# EAGLE schematic Balise ir émmetrice (EAGLE 6.1)
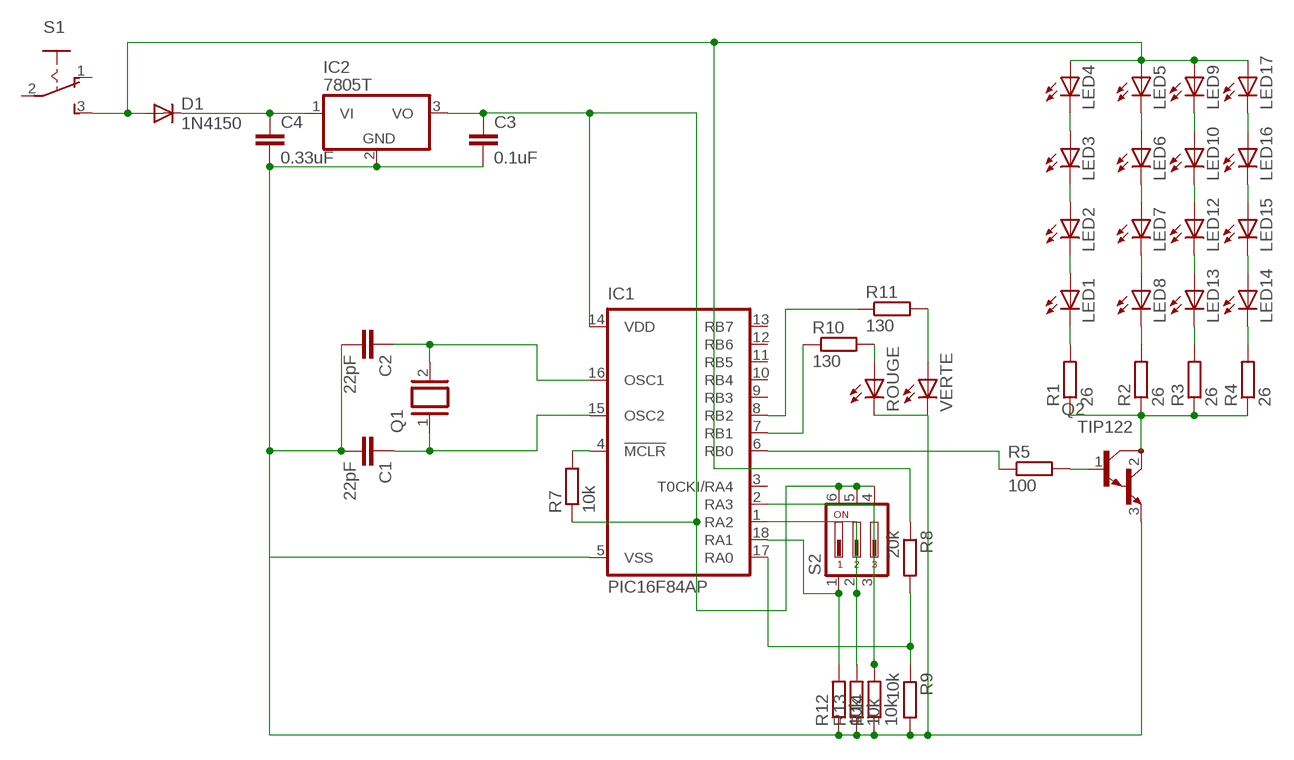
[diagram p0: schematic, sheet 1]

## Parts
C1  22pF  C2.5/4  [C2.5-4]
C2  22pF  C2.5/4  [C2.5-4]
C3  0.1uF  C2.5/4  [C2.5-4]
C4  0.33uF  C2.5/4  [C2.5-4]
D1  1N4150  1N4148DO35-7  [DO35-7]
IC1  PIC16F84AP  [DIL18]
IC2  7805T  [TO220H]
LED1  LED3MM  [LED3MM]
LED2  LED3MM  [LED3MM]
LED3  LED3MM  [LED3MM]
LED4  LED3MM  [LED3MM]
LED5  LED3MM  [LED3MM]
LED6  LED3MM  [LED3MM]
LED7  LED3MM  [LED3MM]
LED8  LED3MM  [LED3MM]
LED9  LED3MM  [LED3MM]
LED10  LED3MM  [LED3MM]
LED12  LED3MM  [LED3MM]
LED13  LED3MM  [LED3MM]
LED14  LED3MM  [LED3MM]
LED15  LED3MM  [LED3MM]
LED16  LED3MM  [LED3MM]
LED17  LED3MM  [LED3MM]
Q1  XTAL/S  [QS]
Q2  TIP122  [TO220]
R1  26  R-EU_0204/7  [0204/7]
R2  26  R-EU_0204/7  [0204/7]
R3  26  R-EU_0204/7  [0204/7]
R4  26  R-EU_0204/7  [0204/7]
R5  100  R-EU_0204/7  [0204/7]
R7  10k  R-EU_0207/5V  [0207/5V]
R8  20k  R-EU_0207/5V  [0207/5V]
R9  10k  R-EU_0207/5V  [0207/5V]
R10  130  R-EU_0207/5V  [0207/5V]
R11  130  R-EU_0207/5V  [0207/5V]
R12  10k  R-EU_0207/5V  [0207/5V]
R13  10k  R-EU_0207/5V  [0207/5V]
R14  10k  R-EU_0207/5V  [0207/5V]
ROUGE  LED5MM  [LED5MM]
S1  255SB  [255SB]
S2  DIP03YL  [DIP03YL]
VERTE  LED5MM  [LED5MM]

## Nets
N$1: IC1.4(!MCLR) R7.2
N$2: IC1.7(RB1) R10.1
N$3: R10.2 ROUGE.A
N$4: C4.1 D1.C IC2.1(VI)
N$5: C1.2 C2.2 C3.2 C4.2 IC1.5(VSS) IC2.2(GND) Q2.3(E) R9.2 R12.1 R13.1 R14.1 ROUGE.K(C) VERTE.K(C)
N$7: C1.1 IC1.15(OSC2) Q1.1
N$8: C2.1 IC1.16(OSC1) Q1.2
N$9: C3.1 IC1.14(VDD) IC2.3(VO) R7.1 S2.4 S2.5 S2.6
N$10: Q2.2(C) R1.1 R2.1 R3.1 R4.1
N$11: IC1.6(RB0) R5.1
N$12: Q2.1(B) R5.2
N$13: LED1.K(C) R1.2
N$14: LED1.A LED2.K(C)
N$15: LED2.A LED3.K(C)
N$16: LED3.A LED4.K(C)
N$17: IC1.1(RA2) R13.2 S2.2
N$18: LED16.A LED17.K(C)
N$19: LED9.K(C) LED10.A
N$20: LED5.K(C) LED6.A
N$21: LED6.K(C) LED7.A
N$22: LED10.K(C) LED12.A
N$23: LED15.A LED16.K(C)
N$24: LED7.K(C) LED8.A
N$25: LED12.K(C) LED13.A
N$26: LED14.A LED15.K(C)
N$27: LED14.K(C) R4.2
N$28: LED13.K(C) R3.2
N$29: LED8.K(C) R2.2
N$31: IC1.8(RB2) R11.1
N$32: R11.2 VERTE.A
N$35: IC1.18(RA1) R12.2 S2.1
N$36: IC1.2(RA3) R14.2 S2.3
N$37: IC1.17(RA0) R8.2 R9.1
N$39: D1.A LED4.A LED5.A LED9.A LED17.A R8.1 S1.3(S)
Unconnected: IC1.3(T0CKI/RA4) IC1.9(RB3) IC1.10(RB4) IC1.11(RB5) IC1.12(RB6) IC1.13(RB7) S1.1(O) S1.2(P)

## Library data of the parts
C1-C4 = capacitor-wima:C: CAPACITOR naming: grid - package width
D1 = diode:1N4148: DIODE high speed (Philips)
IC1 = microchip:PIC16F8*: MICROCONTROLLER 8-Bit PIC16F8X Family - CMOS Flash/EEPROM Pin Compatible : PIC16F83, PIC16CR83, PIC16F84A, PIC16CR84 see also PIC16C* <DEVICE:PIC16C*>; MF: MICROCHIP; MPN: PIC16F84A-04I/P; OC_FARNELL: 9760865; OC_NEWARK: 69K7635
IC2 = linear:78*: Positive VOLTAGE REGULATOR Source: http://cache.national.com/ds/LM/LM78L05.pdf http://www.fairchildsemi.com/ds/LM/LM7805.pdf
LED1-LED10 LED12-LED17 ROUGE VERTE = led:LED: LED OSRAM: - CHIPLED LG R971, LG N971, LY N971, LG Q971, LY Q971, LO R971, LY R971 LH N974, LH R974 LS Q976, LO Q976, LY Q976 LO Q996 - Hyper CHIPLED LW Q18S LB Q993, LB Q99A, LB R99A - SideLED LS A670, LO A670, LY A670, LG A670, LP A670 LB A673, LV A673, LT A673, LW A673 LH A674 LY A675 LS A676, LA A676, LO A676, LY A676, LW A676 LS A679, LY A679, LG A679 - Hyper Micro SIDELED® LS Y876, LA Y876, LO Y876, LY Y876 LT Y87S - SmartLED LW L88C, LW L88S LB L89C, LB L89S, LG L890 LS L89K, LO L89K, LY L89K LS L896, LA L896, LO L896, LY L896 - TOPLED LS T670, LO T670, LY T670, LG T670, LP T670 LSG T670, LSP T670, LSY T670, LOP T670, LYG T670 LG T671, LOG T671, LSG T671 LB T673, LV T673, LT T673, LW T673 LH T674 LS T676, LA T676, LO T676, LY T676, LB T676, LH T676, LSB T676, LW T676 LB T67C, LV T67C, LT T67C, LS T67K, LO T67K, LY T67K, LW E67C LS E67B, LA E67B, LO E67B, LY E67B, LB E67C, LV E67C, LT E67C LW T67C LS T679, LY T679, LG T679 LS T770, LO T770, LY T770, LG T770, LP T770 LB T773, LV T773, LT T773, LW T773 LH T774 LS E675, LA E675, LY E675, LS T675 LS T776, LA T776, LO T776, LY T776, LB T776 LHGB T686 LT T68C, LB T68C - Hyper Mini TOPLED® LB M676 - Mini TOPLED Santana® LG M470 LS M47K, LO M47K, LY M47K Source: http://www.osram.convergy.de LUXEON: - LUMILED® LXK2-PW12-R00, LXK2-PW12-S00, LXK2-PW14-U00, LXK2-PW14-V00 LXK2-PM12-R00, LXK2-PM12-S00, LXK2-PM14-U00 LXK2-PE12-Q00, LXK2-PE12-R00, LXK2-PE12-S00, LXK2-PE14-T00, LXK2-PE14-U00 LXK2-PB12-K00, LXK2-PB12-L00, LXK2-PB12-M00, LXK2-PB14-N00, LXK2-PB14-P00, LXK2-PB14-Q00 LXK2-PR12-L00, LXK2-PR12-M00, LXK2-PR14-Q00, LXK2-PR14-R00 LXK2-PD12-Q00, LXK2-PD12-R00, LXK2-PD12-S00 LXK2-PH12-R00, LXK2-PH12-S00 LXK2-PL12-P00, LXK2-PL12-Q00, LXK2-PL12-R00 Source: www.luxeon.com KINGBRIGHT: KA-3528ASYC Source: www.kingbright.com
Q1 = special:XTAL/S: CRYSTAL
Q2 = transistor-npn:TIP122*: NPN Darlington Transistor
R1-R4 R7-R9 R12-R14 = rcl:R-EU_: RESISTOR, European symbol
R5 R10 R11 = resistor:R-EU_: RESISTOR, European symbol
S1 = switch:255SB: SLIDING SWITCH Distributor Buerklin, 11G810
S2 = switch-dil:DIP03YL: DIL/CODE SWITCH; OC_FARNELL: unknown; OC_NEWARK: unknown